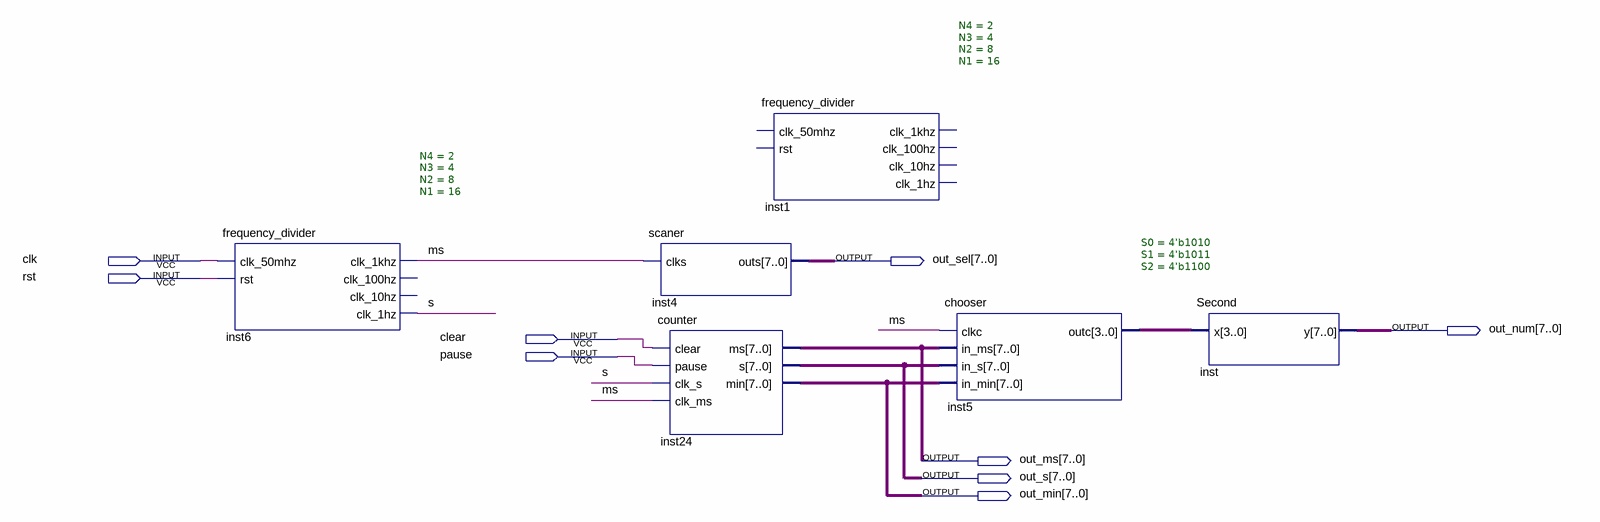
[diagram p0: schematic sheet]
// Quartus schematic Tenth.bdf as structural Verilog: 6 symbols, 9 pins
module Tenth (
  input  clk,
  input  rst,
  input  clear,
  input  pause,
  output [7:0] out_sel,
  output [7:0] out_num,
  output [7:0] out_ms,
  output [7:0] out_s,
  output [7:0] out_min
);

  wire ms, s;
  wire [3:0] inst5_outc;

  frequency_divider #(.N4(2), .N3(4), .N2(8), .N1(16)) inst6 (
    .clk_50mhz(clk), .rst(rst), .clk_1khz(ms), .clk_1hz(s));  // open: clk_100hz, clk_10hz
  scaner inst4 (.clks(ms), .outs(out_sel));
  counter inst24 (.clear(clear), .pause(pause), .clk_s(s), .clk_ms(ms), .ms(out_ms), .s(out_s), .min(out_min));
  frequency_divider #(.N4(2), .N3(4), .N2(8), .N1(16)) inst1 ();  // open: clk_50mhz, rst, clk_1khz, clk_100hz, clk_10hz, clk_1hz
  chooser #(.S0(4'b1010), .S1(4'b1011), .S2(4'b1100)) inst5 (
    .clkc(ms), .in_ms(out_ms), .in_s(out_s), .in_min(out_min), .outc(inst5_outc));
  Second inst (.x(inst5_outc), .y(out_num));
endmodule
